# EAGLE design nano_relay (EAGLE 9.6.0)
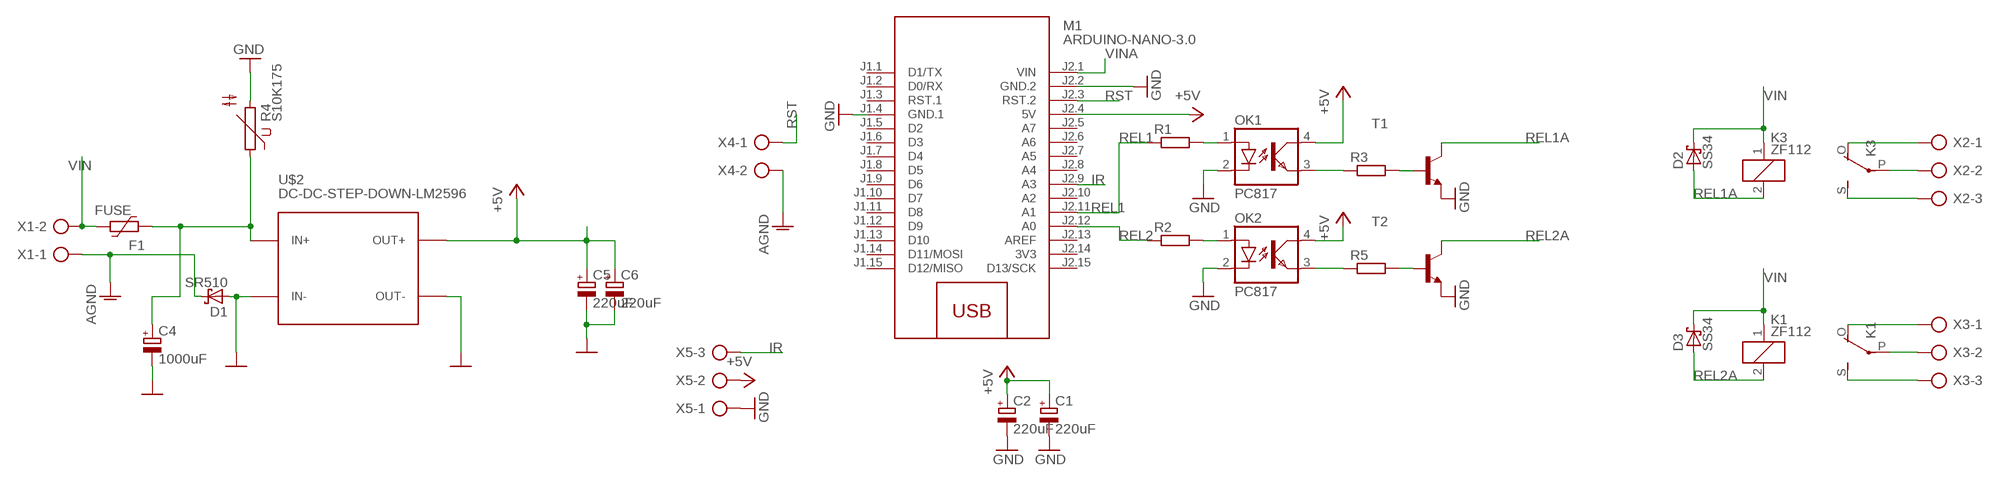
[diagram p0: schematic, sheet 1]

## Parts
C1  220uF  CPOL-EUE2.5-7  [E2,5-7]
C2  220uF  CPOL-EUE2.5-7  [E2,5-7]
C4  1000uF  CPOL-EUE5-8.5  [E5-8,5]
C5  220uF  CPOL-EUE2.5-7  [E2,5-7]
C6  220uF  CPOL-EUE2.5-7  [E2,5-7]
D1  SR510  SCHOTTKY-DIODESMD  [SMB]
D2  SS34  SCHOTTKY-DIODESMD  [SMB]
D3  SS34  SCHOTTKY-DIODESMD  [SMB]
F1  FUSE  1812L010  [1812L]
K1  ZF112  [ZF112]
K3  ZF112  [ZF112]
M1  ARDUINO-NANO-3.0  [ARDUINO-NANO-3.0]
OK1  PC817  [DIL04]
OK2  PC817  [DIL04]
R1  R-EU_M0805  [M0805]
R2  R-EU_M0805  [M0805]
R3  R-EU_M0805  [M0805]
R4  S10K175  [S10K175]
R5  R-EU_M0805  [M0805]
T1  MMBT2222ALT1-NPN-SOT23-BEC  [SOT23-BEC]
T2  MMBT2222ALT1-NPN-SOT23-BEC  [SOT23-BEC]
U$2  DC-DC-STEP-DOWN-LM2596  [DC-DC-STEP-DOWN-LM2596]
X1  AK300/2  [AK300/2]
X2  AK300/3  [AK300/3]
X3  AK300/3  [AK300/3]
X4  AK300/2  [AK300/2]
X5  AK300/3  [AK300/3]

## Nets
+5V: C1.+ C2.+ C5.+ C6.+ M1.J2.4(5V) OK1.4(COL) OK2.4(COL) U$2.OUT+ X5.2
AGND: D1.C X1.1 X4.2
GND: C1.- C2.- C4.- C5.- C6.- D1.A M1.J1.4(GND.1) M1.J2.2(GND.2) OK1.2(C) OK2.2(C) R4.2 T1.E T2.E U$2.IN- U$2.OUT- X5.1
IR: M1.J2.9(A3) X5.3
N$1: OK1.1(A) R1.2
N$2: OK2.1(A) R2.2
N$3: K3.P(2:P) X2.2
N$4: C4.+ F1.2 R4.1 U$2.IN+
N$7: K1.P(2:P) X3.2
N$8: K1.O(2:O) X3.1
N$9: K1.S(2:S) X3.3
N$10: OK1.3(EMIT) R3.1
N$11: OK2.3(EMIT) R5.1
N$12: R3.2 T1.B
N$13: R5.2 T2.B
N$17: K3.O(2:O) X2.1
N$18: K3.S(2:S) X2.3
REL1: M1.J2.11(A1) R1.1
REL1A: D2.A K3.2 T1.C
REL2: M1.J2.12(A0) R2.1
REL2A: D3.A K1.2 T2.C
RST: M1.J2.3(RST.2) X4.1
VIN: D2.C D3.C F1.1 K1.1 K3.1 X1.2
VINA: M1.J2.1(VIN)
Unconnected: M1.J1.1(D1/TX) M1.J1.2(D0/RX) M1.J1.3(RST.1) M1.J1.5(D2) M1.J1.6(D3) M1.J1.7(D4) M1.J1.8(D5) M1.J1.9(D6) M1.J1.10(D7) M1.J1.11(D8) M1.J1.12(D9) M1.J1.13(D10) M1.J1.14(D11/MOSI) M1.J1.15(D12/MISO) M1.J2.5(A7) M1.J2.6(A6) M1.J2.7(A5) M1.J2.8(A4) M1.J2.10(A2) M1.J2.13(AREF) M1.J2.15(D13/SCK)

## Power pins joined to a net without a drawn wire
3V3: M1.J2.14(3V3)

## Library data of the parts
C1 C2 C4-C6 = rcl:CPOL-EU: POLARIZED CAPACITOR, European symbol; SPICEPREFIX: C
D1-D3 = diode:SCHOTTKY-DIODE: Schottky Diode
F1 = polyfuse-smd_10:?: Polyfuse Resettable PTC Source: http://www.littelfuse.com/products/resettable-ptcs.aspx; MF: Littelfuse; MPN: 1812L010; OC_FARNELL: 1822210; OC_NEWARK: 78R5551
K1 K3 = relay:ZF112: RELAY 1 x switch; OC_FARNELL: unknown; OC_NEWARK: unknown
M1 = diy-modules:ARDUINO-NANO-3.0: Arduino Nano 3.0 and compatible devices More details available here: https://www.arduino.cc/en/Main/ArduinoBoardNano Click here to find device on ebay.com <http://www.ebay.com/sch/arduino+nano>
OK1 OK2 = optocoupler:PC817: SHARP OPTO COUPLER; MPN: PC817X4J000F; OC_FARNELL: 9707727; OC_NEWARK: 97K7059
R1-R3 R5 = rcl:R-EU_: RESISTOR, European symbol; SPICEPREFIX: R
R4 = varistor:S10K175: VARISTOR
T1 T2 = transistor:*-NPN-: NPN Transistror BF959 corrected 2008.03.06
U$2 = diy-modules:DC-DC-STEP-DOWN-LM2596: DC/DC Step-Down Regulator based on LM2596-ADJ chip LM2596 datasheet available here: http://www.ti.com/lit/ds/symlink/lm2596.pdf Click here to find device on ebay.com <http://www.ebay.com/sch/lm2596+power+regulator>
X1 X4 = con-ptr500:AK300/2: CONNECTOR; OC_FARNELL: unknown; OC_NEWARK: unknown
X2 X3 X5 = con-ptr500:AK300/3: CONNECTOR; OC_FARNELL: unknown; OC_NEWARK: unknown

## Net classes
0 default: width 0.152 mm, drill 0.152 mm, clearance 0.66 mm

## Board
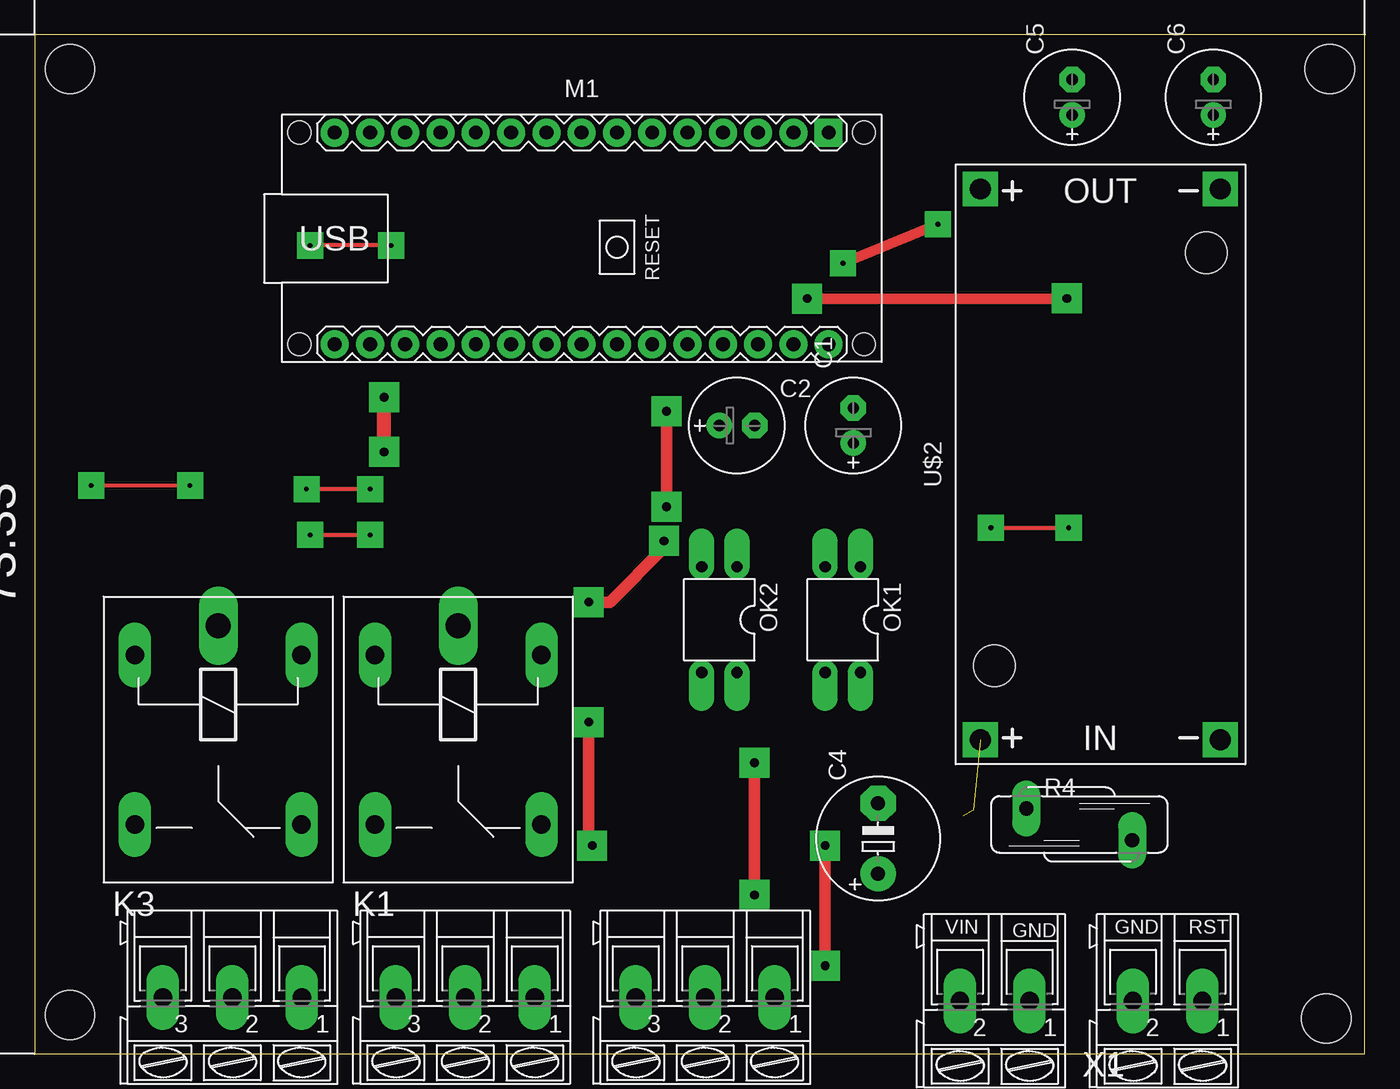
[diagram p1: board, top side]
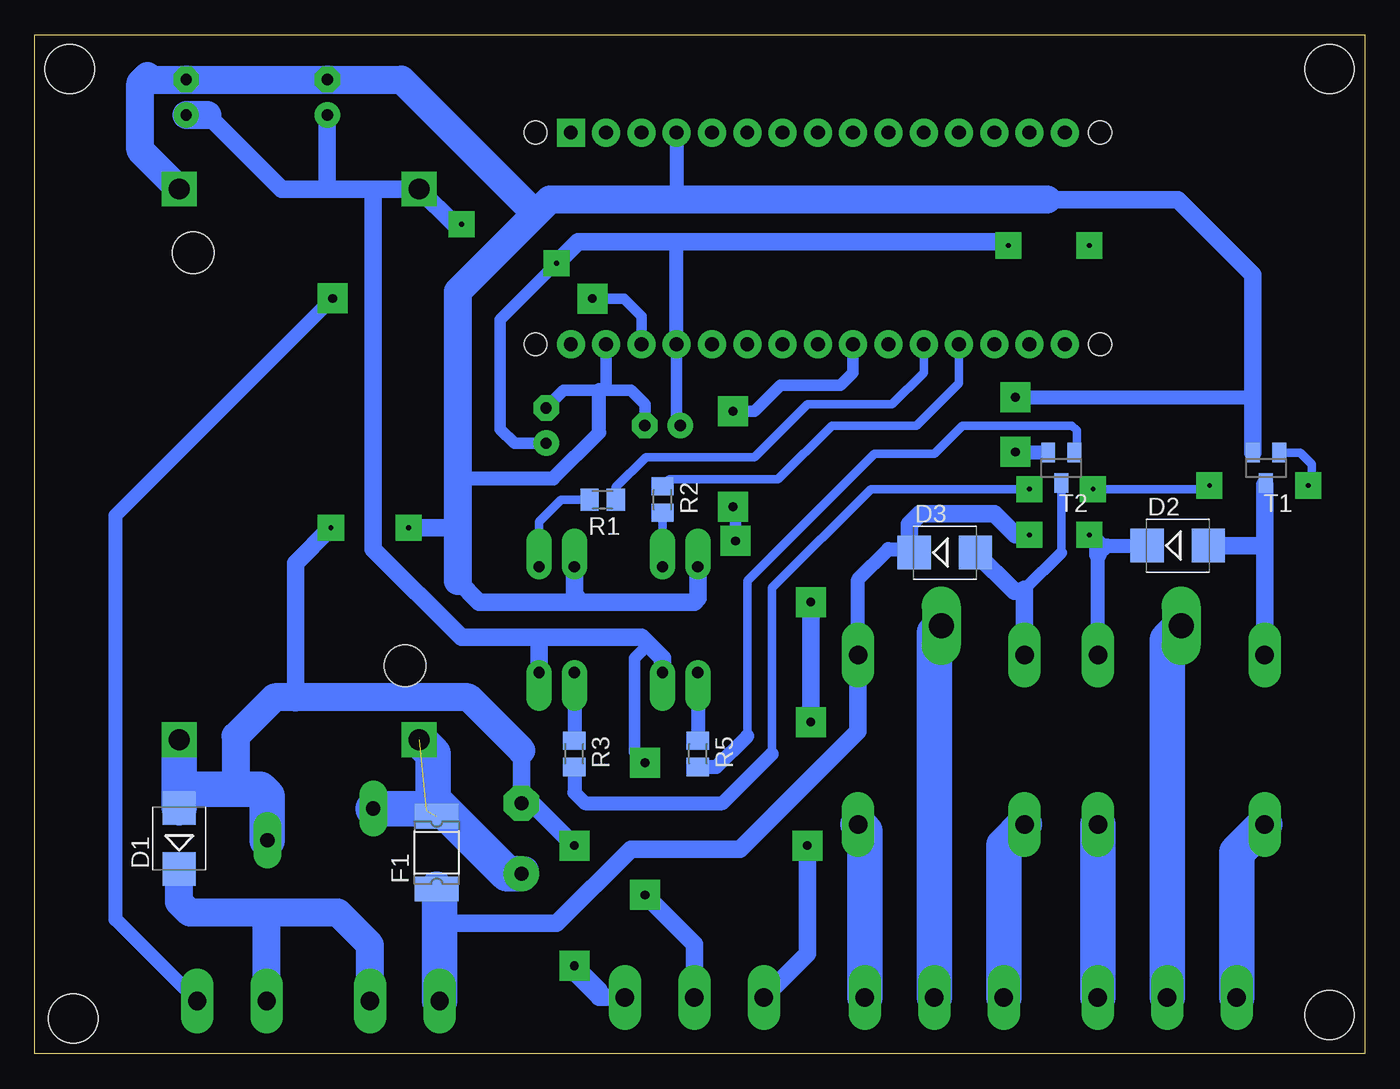
[diagram p2: board, bottom side, seen from below]

Size 95.74 x 73.33 mm. Coordinates in mm from the lower left corner, seen from the top.
Outline: 0,0 95.74,0 95.74,73.33 0,73.33 0,0
Copper layers (1*16): Top 0.035mm / dielectric 1.5mm / Bottom 0.035mm
Design rules "setting": minimum track width 30mil, minimum drill 25mil, track to track 30mil, track to pad 30mil, pad to pad 30mil, via to via 30mil, smd to smd 8mil, copper to edge 50mil, drill to drill 30mil, minimum pad ring 20mil, minimum via ring 30mil, stop-mask expansion 0mil, vias tented up to drill 0mil, thermal gap 10mil
Holes 3.56 mm at 2.54,70.87 2.54,2.79 92.96,2.54 93.22,70.87

### Footprints (pad centres in the part's own frame; a part is rotated, then mirrored left to right if it is on the bottom)
E2,5-7 = drill 0.813 pad 1.6: + -1.27,0 | drill 0.813 pad 1.6 octagon: - 1.27,0
E5-8,5 = drill 1.016 pad 2.54: + -2.54,0 | drill 1.016 pad 2.54 octagon: - 2.54,0
SMB = smd 2.4 x 2.4: A 2.2,0; C -2.2,0
1812L = smd 1.78 x 3.15: 1 -2.62,0; 2 2.62,0
ZF112 = drill 1.321 long: 1 -6.096,5.994; 2 -6.096,-5.994; O 6.096,5.994; S 6.096,-5.994 | drill 1.803 long: P -8.204,0
ARDUINO-NANO-3.0 = drill 1 square: J1.1 17.78,7.62 | drill 1: J1.2 15.24,7.62; J1.3 12.7,7.62; J1.4 10.16,7.62; J1.5 7.62,7.62; J1.6 5.08,7.62; J1.7 2.54,7.62; J1.8 0,7.62; J1.9 -2.54,7.62; J1.10 -5.08,7.62; J1.11 -7.62,7.62; J1.12 -10.16,7.62; J1.13 -12.7,7.62; J1.14 -15.24,7.62; J1.15 -17.78,7.62; J2.1 17.78,-7.62; J2.2 15.24,-7.62; J2.3 12.7,-7.62; J2.4 10.16,-7.62; J2.5 7.62,-7.62; J2.6 5.08,-7.62; J2.7 2.54,-7.62; J2.8 0,-7.62; J2.9 -2.54,-7.62; J2.10 -5.08,-7.62; J2.11 -7.62,-7.62; J2.12 -10.16,-7.62; J2.13 -12.7,-7.62; J2.14 -15.24,-7.62; J2.15 -17.78,-7.62 | hole 1.651: -20.32,7.62; -20.32,-7.62; 20.32,-7.62; 20.32,7.62
DIL04 = drill 0.813 offset: 1 -1.27,-3.81; 2 1.27,-3.81; 3 1.27,3.81; 4 -1.27,3.81
M0805 = smd 1.3 x 1.6: 1 -0.95,0; 2 0.95,0
S10K175 = drill 1.016 long: 1 -1.143,-3.81; 2 1.143,3.81
SOT23-BEC = smd 1 x 1.4: B -0.95,-1.1; C 0,1.1; E 0.95,-1.1
DC-DC-STEP-DOWN-LM2596 = drill 1.5 pad 2.5 square: IN+ -19.812,8.636; IN- -19.812,-8.636; OUT+ 19.812,8.636; OUT- 19.812,-8.636 | hole 3: -14.478,7.62; 15.24,-7.62
AK300/2 = drill 1.321 long: 1 -2.515,0; 2 2.489,0
AK300/3 = drill 1.321 long: 1 -5.004,0; 2 0,0; 3 5.004,0

### Placement (x,y rotation side)
C1  58.93,45.21 90 top
C2  50.55,45.21 0 top
C4  60.71,15.49 90 top
C5  74.68,68.83 90 top
C6  84.84,68.83 90 top
D1  85.34,15.49 90 bottom
D2  13.46,36.58 0 bottom
D3  30.23,36.07 0 bottom
F1  66.8,14.48 90 bottom
K1  30.48,22.61 270 top
K3  13.21,22.61 270 top
M1  39.37,58.67 0 top
OK1  58.17,31.24 180 top
OK2  49.28,31.24 180 top
R1  54.86,39.88 180 bottom
R2  50.55,39.88 270 bottom
R3  56.9,21.59 270 bottom
R4  75.18,16.51 270 top
R5  48.01,21.59 270 bottom
T1  7.11,42.16 180 bottom
T2  21.84,42.16 180 bottom
U$2  76.71,42.42 90 top
X1  69.09,3.81 180 top
X2  14.22,4.06 180 top
X3  30.99,4.06 180 top
X4  81.53,3.81 180 top
X5  48.26,4.06 180 top

### Tracks (layer width: path | path; a pad name or v marks a point on that pad's centre or on a via)
+5V  (via drill 0.35, 0.64)
  Top 0.305: v25.65,58.17 v19.81,58.17
  Top 0.762: v58.17,56.9 v65.02,59.69
  Top 0.813: v51.82,20.96 v51.82,11.43
  Bottom 0.813: v51.82,20.96 52.58,21.72 52.58,28.45 51.56,29.46 | M1.J2.4 49.53,45.47 C2.+ | C1.+ 61.21,43.94 62.23,44.96 62.23,52.83 v58.17,56.9
  Bottom 1.016: M1.J2.4 49.53,58.42
  Bottom 1.27: 71.37,62.23 U$2.OUT+ 65.53,59.69 v65.02,59.69 | 71.37,62.23 74.68,62.23 | 74.68,62.23 77.98,62.23 83.31,67.56 | C5.+ 74.68,62.23 | OK2.4 50.55,28.45 51.56,29.46 52.07,29.97 59.44,29.97 | 71.37,62.23 71.37,36.32 65.02,29.97 59.44,29.97 | OK1.4 59.44,29.97 | v58.17,56.9 56.64,58.42 49.53,58.42 25.91,58.42 v25.65,58.17 | X5.2 48.26,7.87 v51.82,11.43
  Bottom 2.032: C6.+ 83.31,67.56
AGND
  Bottom 2.032: X1.1 71.6,7.85 73.91,10.16 78.99,10.16 | 78.99,10.16 84.58,10.16 85.34,10.92 D1.C | X4.2 79.05,10.11 78.99,10.16
GND  (via drill 0.35, 0.64)
  Top 0.305: v68.83,37.85 v74.42,37.85
  Top 0.813: v56.9,6.35 v56.9,14.99
  Top 1.016: v25.15,43.31 v25.15,47.24
  Bottom 0.61: 22.86,43.33 T2.E
  Bottom 0.813: 55.12,4.06 55.37,4.06 56.9,5.59 v56.9,6.35 | v56.9,14.99 60.71,18.8 | C2.- 51.82,46.74 52.83,47.75 54.61,47.75 | M1.J2.2 54.61,47.75 | C1.- 57.66,47.75 55.12,47.75 54.61,47.75
  Bottom 1.016: T2.E 25.1,43.26 v25.15,43.31 | v25.15,47.24 8.32,47.24 8.06,47.5 | M1.J1.4 49.53,61.47 | 65.28,41.4 58.42,41.4 55.12,44.7 55.12,47.75
  Bottom 1.27: OK1.2 56.9,33.02 56.39,32.51 | 56.39,32.51 48.26,32.51 48.01,32.77 OK2.2 | 56.39,32.51 63.75,32.51 65.28,34.04 | 65.28,37.85 v68.83,37.85 | v74.42,37.85 76.96,35.31 76.96,25.65 | T1.E 8.06,47.5 8.06,56.07 13.46,61.47 22.86,61.47 | 60.71,21.84 C4.- 59.94,18.03 v56.9,14.99 | X5.1 55.12,4.06 55.12,4.57 v56.9,6.35
  Bottom 2.032: U$2.OUT- 88.14,65.02 88.14,69.85 87.88,70.1 | 87.88,70.1 87.63,70.36 | 81.28,19.05 81.28,22.86 78.49,25.65 76.96,25.65 64.52,25.65 60.71,21.84 | 65.28,34.04 65.28,37.85 65.28,41.4 65.28,54.86 59.69,60.45 | 22.86,61.47 49.53,61.47 58.67,61.47 59.69,60.45 | 59.69,60.45 69.34,70.1 C5.- C6.- 87.88,70.1
  Bottom 2.54: D1.A 85.34,19.05 | 85.34,19.05 U$2.IN- | R4.2 78.99,18.54 79.5,19.05 81.28,19.05 85.34,19.05
IR  (via drill 0.64)
  Top 0.813: v39.88,23.88 39.88,15.24 v40.13,14.99 | v45.29,36.91 45.29,36.4 41.4,32.51 v39.88,32.51 | v45.47,46.23 v45.47,39.37
  Bottom 0.813: v45.29,36.91 45.29,39.19 v45.47,39.37 | v45.47,46.23 43.94,46.23 42.06,48.11 37.74,48.11 36.83,49.02 M1.J2.9
  Bottom 1.27: X5.3 40.13,7.19 v40.13,14.99 | v39.88,23.88 v39.88,32.51
N$1
  Bottom 0.61: OK1.1 59.44,38.29 57.85,39.88 R1.2
N$2
  Bottom 0.61: OK2.1 R2.2
N$3
  Bottom 2.54: X2.2 14.22,29.79 K3.P
N$4  (2 unrouted)
  Bottom 2.032: 60.45,13.21 C4.+
  Bottom 2.54: C4.+ 61.72,12.95 67.06,18.29 67.06,21.59 U$2.IN+ | R4.1 67.69,17.65 67.56,17.53
N$7
  Bottom 2.54: X3.2 30.99,30.3 K1.P
N$8
  Bottom 2.54: X3.1 35.99,16.03 K1.O
N$9
  Bottom 2.54: X3.3 25.98,15.01 K1.S
N$10
  Bottom 1.016: OK1.3 R3.1
N$11
  Bottom 1.016: OK2.3 R5.1
N$12  (via drill 0.35)
  Top 0.305: v24.13,40.64 v19.56,40.64 | v11.18,40.89 v4.06,40.89
  Bottom 0.61: 42.67,21.59 42.67,33.53 35.56,40.64 v24.13,40.64 | v4.06,40.89 3.81,41.15 3.81,42.42 4.66,43.26 T1.B | v19.56,40.64 11.43,40.64 v11.18,40.89
  Bottom 1.016: R3.2 56.9,18.8 56.13,18.03 46.23,18.03 42.67,21.59
N$13
  Bottom 0.61: 44.45,22.86 44.45,34.04 35.31,43.18 30.99,43.18 28.96,45.21 21.08,45.21 20.72,44.85 20.72,43.43 T2.B
  Bottom 1.016: R5.2 46.67,20.64 44.45,22.86
N$17
  Bottom 2.54: X2.1 19.23,16.49 K3.O
N$18
  Bottom 2.54: X2.3 9.22,14.5 K3.S
REL1
  Bottom 0.61: R1.1 53.91,40.76 51.75,42.93 43.94,42.93 40.13,46.74 34.04,46.74 31.75,49.02 M1.J2.11
REL1A
  Bottom 0.813: 7.21,40.96 T1.C
  Bottom 1.27: K3.2 7.21,36.58 | 7.21,36.58 7.21,40.96 | D2.A 7.21,36.58
REL2
  Bottom 0.61: R2.1 50.04,41.34 42.23,41.34 38.35,45.21 32.26,45.21 29.21,48.26 M1.J2.12
REL2A
  Bottom 0.61: 21.84,36.07 T2.C
  Bottom 0.813: 21.84,36.07 24.49,33.43 24.64,33.27
  Bottom 1.27: K1.2 24.49,33.43 | D3.A 25.23,33.27 24.64,33.27
RST  (via drill 0.64)
  Top 0.762: v55.6,54.35 v74.29,54.35 v74.3,54.36
  Bottom 0.762: M1.J2.3 52.07,53.09 53.34,54.35 v55.6,54.35
  Bottom 1.016: X4.1 89.92,9.68 89.92,38.74 v74.3,54.36
VIN  (via drill 0.35)
  Top 0.305: v19.81,37.34 v24.13,37.34
  Bottom 1.016: K3.1 19.2,35.92 18.54,36.58 D2.C | K1.1 36.47,34.14 34.29,36.32 32.77,36.32 | 32.77,36.07 D3.C
  Bottom 1.27: K1.1 36.47,23.22 44.96,14.73 52.83,14.73 58.17,9.4 66.6,9.4 | 19.2,35.92 19.2,36.73 v19.81,37.34 | 32.77,36.07 32.77,36.32 32.77,38.1 32,38.86 26.67,38.86 25.15,37.34 v24.13,37.34
  Bottom 2.54: X1.2 66.6,9.4 66.6,11.65 F1.1

### Text on the board
tPlace: VIN | GND | GND | RST